# Altium schematic sheet LED.SchDoc
size A
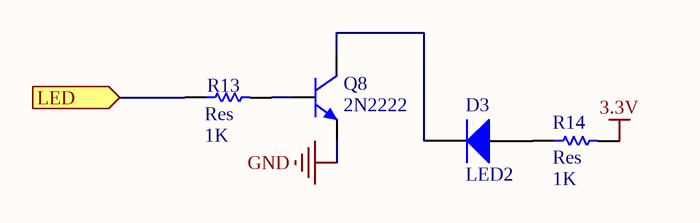
[diagram p0: LED.SchDoc]

## Parts
D3  LED2  [2012[0805]]
Q8  2N2222  [SOT-23]
R13  Res  value 1K  [2012[0805]]
R14  Res  value 1K  [2012[0805]]

## Ports
LED (in)

## Nets
3.3V: R14.2
GND: Q8.3(E)
LED: R13.1 ; port LED
NetD3_1: D3.1(A) R14.1
NetD3_2: D3.2(K) Q8.1(C)
NetQ8_2: Q8.2(B) R13.2

## Library data of the parts
D3 = Diode: 1 Amp General Purpose Rectifier; Revision 1: 11-Jul-2000: SIM Model Added.; Revision 2: 17-Jul-2002: Re-released for DXP Platform.; Package Information: Latest Revision: Aug-1999; Code - JEDEC: DO-204-AL; Published: 8-Jun-2000; Datasheet: Latest Revision: 1998; Package Reference: DO-41; Publisher: Altium Limited
Q8 = 2N2222: NPN Bipolar Transistor; Published: 8-Jun-2000; LatestRevisionDate: 17-Jul-2002; LatestRevisionNote: Re-released for DXP Platform.; PackageReference: TO-226; Publisher: Altium Limited; Code_JEDEC: TO-226-AA
R13 R14 = Res: Semiconductor Resistor; Published: 8-Jun-2000; LatestRevisionDate: 17-Jul-2002; LatestRevisionNote: Re-released for DXP Platform.; PackageReference: AXIAL-0.5; Publisher: Altium Limited